# Altium schematic sheet WX0.010.828DL.SchDoc
size A3
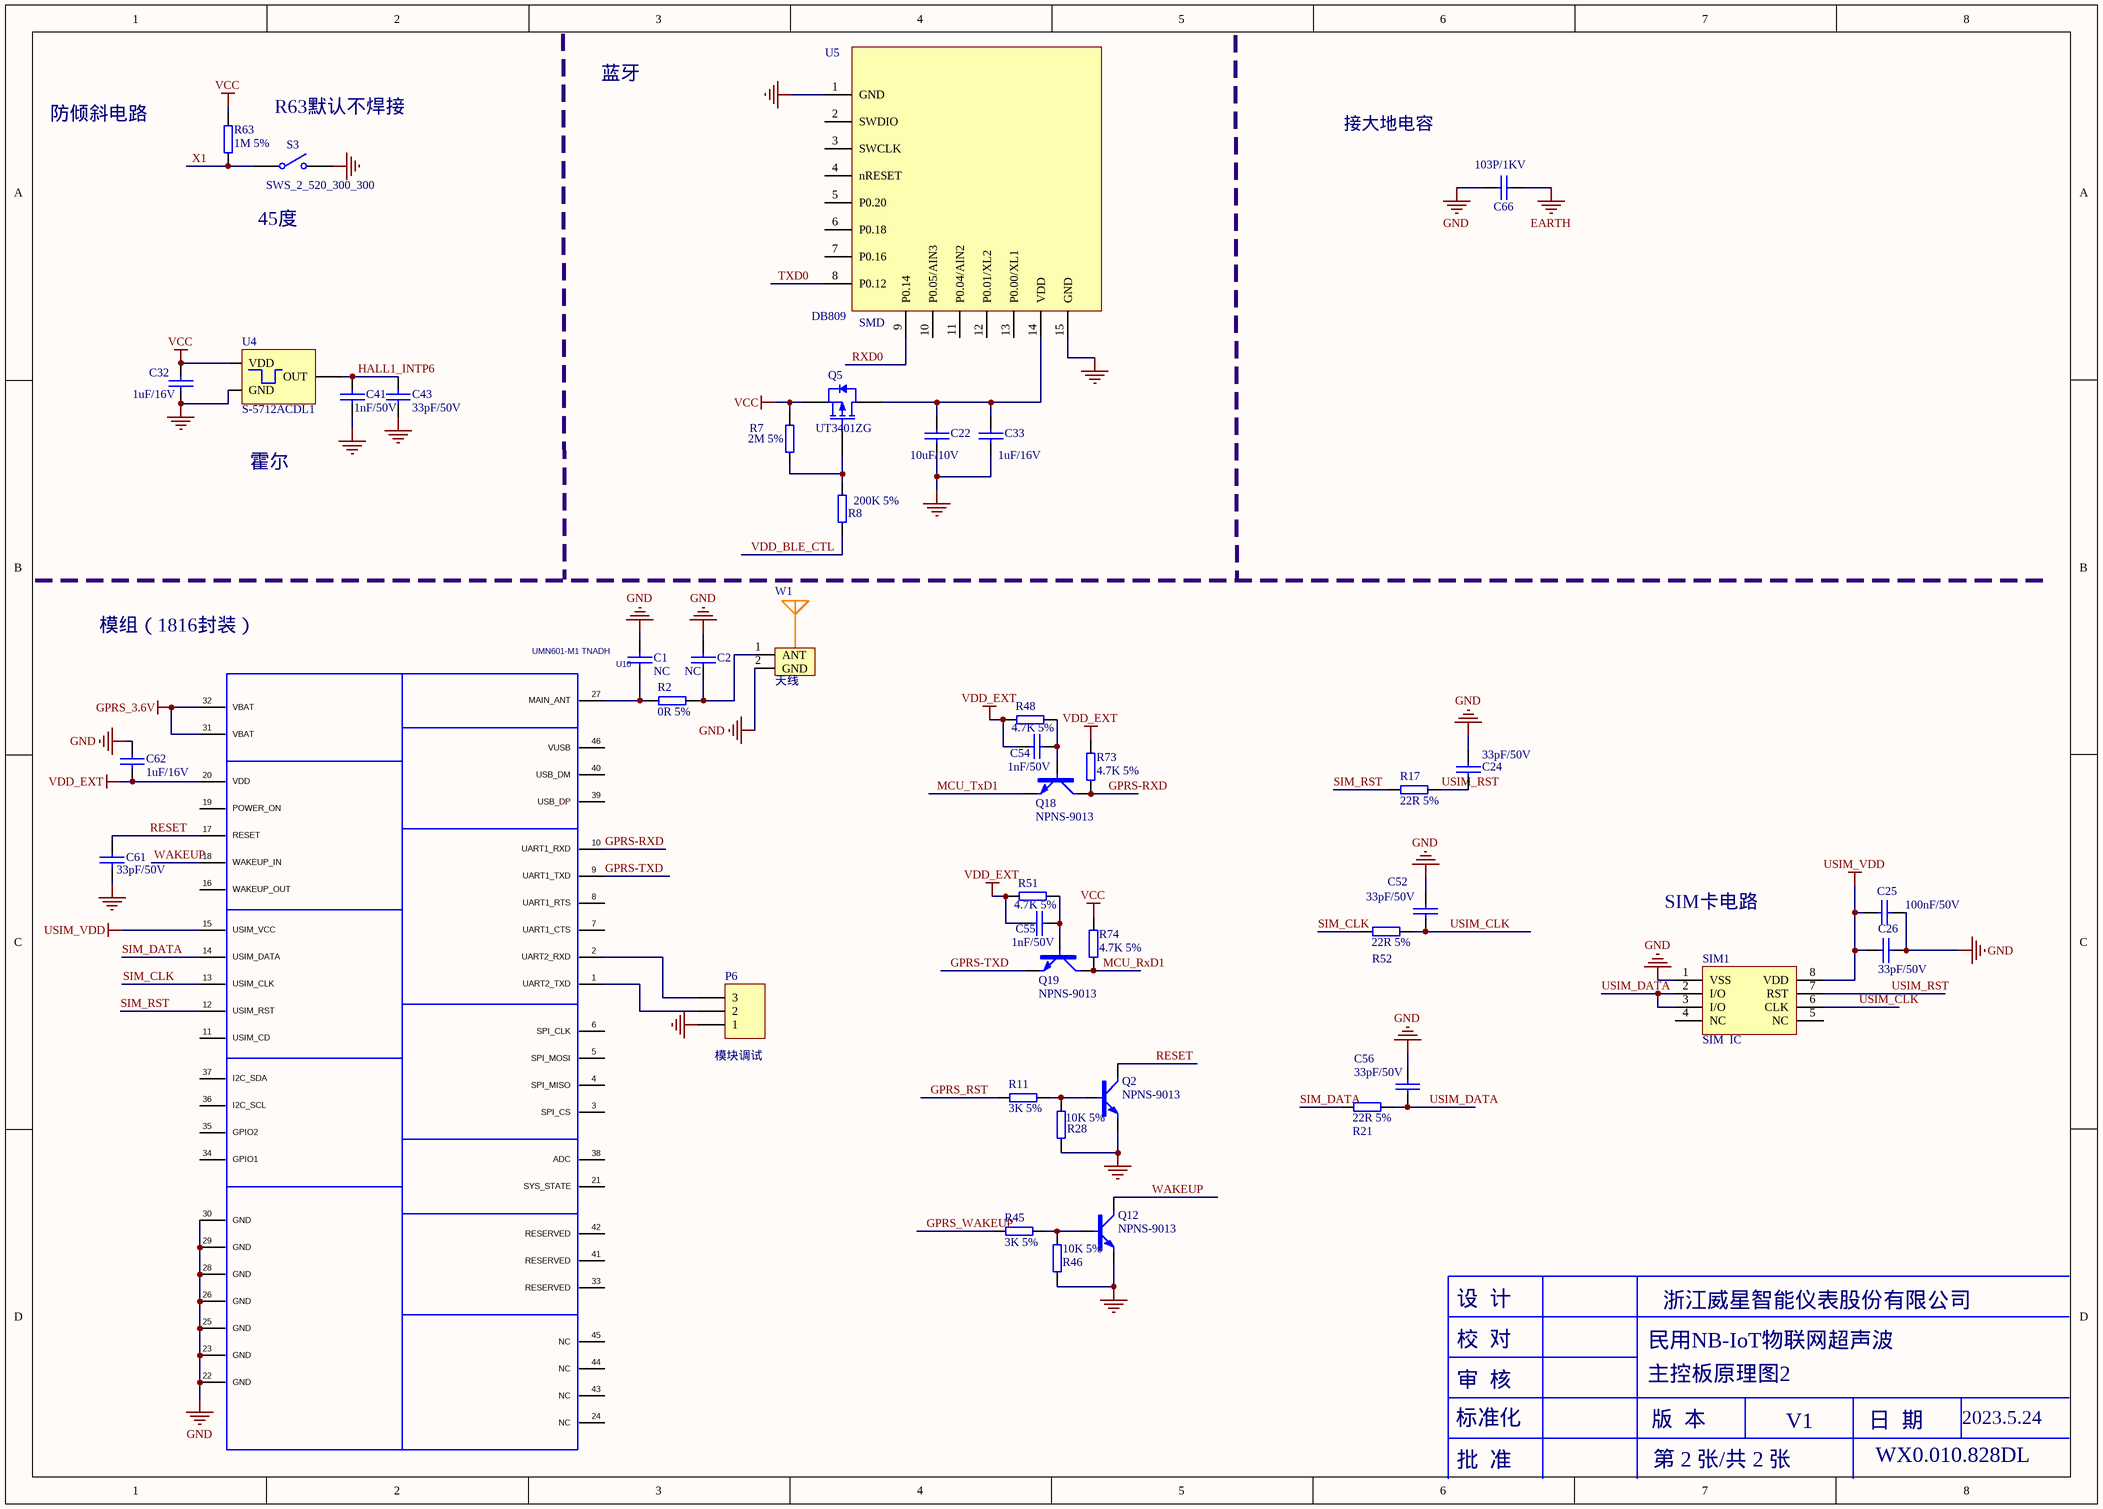
[diagram p0: WX0.010.828DL.SchDoc]

## Parts
C1  NC  [CAP0603]
C2  NC  [CAP0603]
C22  10uF/10V  [CAP0603]
C24  33pF/50V  [CAP0603]
C25  100nF/50V  [CAP0603]
C26  33pF/50V  [CAP0603]
C32  1uF/16V  [CAP0603]
C33  1uF/16V  [CAP0603]
C41  1nF/50V  [CAP0603]
C43  33pF/50V  [CAP0603]
C52  33pF/50V  [CAP0603]
C54  1nF/50V  [CAP0603]
C55  1nF/50V  [CAP0603]
C56  33pF/50V  [CAP0603]
C61  33pF/50V  [CAP0603]
C62  1uF/16V  [CAP0603]
C66  103P/1KV  [CAP1206]
P6  模块调试  [PIN254_1*3*WXHJ]
Q2  NPNS-9013  [SOT-23]
Q5  UT3401ZG  [SOT-23]
Q12  NPNS-9013  [SOT-23]
Q18  NPNS-9013  [SOT-23]
Q19  NPNS-9013  [SOT-23]
R2  0R 5%  [RES0603]
R7  2M 5%  [RES0603]
R8  200K 5%  [RES0603]
R11  3K 5%  [RES0603]
R17  22R 5%  [RES0603]
R21  22R 5%  [RES0603]
R28  10K 5%  [RES0603]
R45  3K 5%  [RES0603]
R46  10K 5%  [RES0603]
R48  4.7K 5%  [RES0603]
R51  4.7K 5%  [RES0603]
R52  22R 5%  [RES0603]
R63  1M 5%  [RES0603]
R73  4.7K 5%  [RES0603]
R74  4.7K 5%  [RES0603]
S3  SWS_2_520_300_300  [SWS_2_520_300]
SIM1  SIM  IC  [SIMIC]
U4  S-5712ACDL1  [SOT-23]
U5  DB809  SMD/DIP: SMD  [DB809]
U10  UMN601-M1 TNADH  [N700-FIXTURE_DL_CFT_CQA]
W1  天线  [ANT-tanpian]

## Nets
EARTH: C66.1
GND: C1.2 C2.2 C22.2 C24.2 C25.1 C26.2 C32.2 C33.2 C41.2 C43.2 C52.2 C56.2 C61.1 C62.2 C66.2 P6.1 Q2.2(E) Q12.2(E) R28.1 R46.1 S3.2 SIM1.1(VSS) U4.3(GND) U5.1(GND) U5.15(GND) U10.22(GND) U10.23(GND) U10.25(GND) U10.26(GND) U10.28(GND) U10.29(GND) U10.30(GND) W1.2(GND)
GPRS_3.6V: U10.31(VBAT) U10.32(VBAT)
USIM_VDD: C25.2 C26.1 SIM1.8(VDD) U10.15(USIM_VCC)
VCC: C32.1 Q5.2(S) R7.2 R63.2 R74.2 U4.1(VDD)
VDD_EXT: C54.1 C55.1 C62.1 R48.2 R51.2 R73.2 U10.20(VDD)
GPRS-RXD: Q18.3(C) R73.1 U10.10(UART1_RXD)
GPRS-TXD: Q19.2(E) U10.9(UART1_TXD)
GPRS_RST: R11.1
GPRS_WAKEUP: R45.1
HALL1_INTP6: C41.1 C43.1 U4.2(OUT)
MCU_RxD1: Q19.3(C) R74.1
MCU_TxD1: Q18.2(E)
RESET: C61.2 Q2.3(C) U10.17(RESET)
RXD0: U5.9(P0.14)
SIM_CLK: R52.1 U10.13(USIM_CLK)
SIM_DATA: R21.1 U10.14(USIM_DATA)
SIM_RST: R17.1 U10.12(USIM_RST)
TXD0: U5.8(P0.12)
USIM_CLK: C52.1 R52.2 SIM1.6(CLK)
USIM_DATA: C56.1 R21.2 SIM1.2(I/O) SIM1.3(I/O)
USIM_RST: C24.1 R17.2 SIM1.7(RST)
VDD_BLE_CTL: R8.1
WAKEUP: Q12.3(C) U10.18(WAKEUP_IN)
X1: R63.1 S3.1
NetC1_1: C1.1 R2.2 U10.27(MAIN_ANT)
NetC2_1: C2.1 R2.1 W1.1(ANT)
NetC22_1: C22.1 C33.1 Q5.3(D) U5.14(VDD)
NetC54_2: C54.2 Q18.1(B) R48.1
NetC55_2: C55.2 Q19.1(B) R51.1
NetP6_2: P6.2 U10.1(UART2_TXD)
NetP6_3: P6.3 U10.2(UART2_RXD)
NetQ2_1: Q2.1(B) R11.2 R28.2
NetQ5_1: Q5.1(G) R7.1 R8.2
NetQ12_1: Q12.1(B) R45.2 R46.2

Not connected (* = marked no-connect by the designer): SIM1 4(NC) 5(NC); U5 2(SWDIO) 3(SWCLK) 4(nRESET) 5(P0.20) 6(P0.18) 7(P0.16) 10(P0.05/AIN3) 11(P0.04/AIN2) 12(P0.01/XL2) 13(P0.00/XL1); U10 3(SPI_CS) 4(SPI_MISO) 5(SPI_MOSI) 6(SPI_CLK) 7(UART1_CTS) 8(UART1_RTS) 11(USIM_CD) 16(WAKEUP_OUT) 19(POWER_ON) 21(SYS_STATE) 24(NC) 33(RESERVED) 34(GPIO1) 35(GPIO2) 36(I2C_SCL) 37(I2C_SDA) 38(ADC) 39(USB_DP) 40(USB_DM) 41(RESERVED) 42(RESERVED) 43(NC) 44(NC) 45(NC) 46(VUSB)

## Notes on the sheet
- R63默认不焊接
- 蓝牙
- 防倾斜电路
- 接大地电容
- 45度
- 霍尔
- 模组（1816封装）
- SIM卡电路
- 设  计
- 浙江威星智能仪表股份有限公司
- 审  核
- 校  对
- 民用NB-IoT物联网超声波
- 主控板原理图2
- 标准化
- 版  本
- V1
- 日  期
- WX0.010.828DL
- 2023.5.24
- 批  准
- 第 2 张/共 2 张

## Library data of the parts
C1 C2 = 101020103-0005: Part Name: 0603贴片电容; ID: 11; SMD/DIP: SMD
C22 = 101020103-0026: 106pF,10 V,±10%,0603,村田,GRM188R61A106KE47D; Part Name: 0603贴片电容; ID: 8; SMD/DIP: SMD; Part Number: 101020103-0026
C24 C26 C43 C52 C56 = 101020103-0027: 33pF,50 V,±10%,0603,国巨,CC0603KRNPO9BN33; Part Name: 0603贴片电容; ID: 17; SMD/DIP: SMD; Part Number: 101020103-0027
C25 = 101020103-0021: 104pF,50 V,±10%,0603,国巨,CC0603KRX7R9BB104; Part Name: 0603贴片电容; ID: 3; SMD/DIP: SMD; Part Number: 101020103-0021
C32 C33 C62 = 101020103-0003: 105pF,16 V,±10%,0603,国巨,CC0603KRX7R7BB105; Part Name: 0603贴片电容; ID: 14; SMD/DIP: SMD; Part Number: 101020103-0003
C41 C54 C55 = 101020103-0022: 102pF,50 V,±10%,0603,国巨,CC0603KRX7R9BB102; Part Name: 0603贴片电容; ID: 13; SMD/DIP: SMD; Part Number: 101020103-0022
C61 = 101020103-0027: 33pF,50 V,±10%,0603,国巨,CC0603KRNPO9BN33; Part Name: 0603贴片电容; ID: 18; SMD/DIP: SMD; Part Number: 101020103-0027
C66 = 101020103-0021: 103P/1KV,±10％,1206; Part Number: 101020101-0003; Part Name: 1206贴片电容; ID: 3; SMD/DIP: SMD
P6 = AD_WXHJ_PinHeader_04: 1*3 ，Φ1.0 ，2.54mm，直脚,无需焊接器件; Part Name: 排针; ID: 27; SMD/DIP: DIP; Part Number: AD_WXHJ_PinHeader_04
Q2 Q12 Q18 Q19 = 101040201-0002: 9013,NPN,SOT-23,长电,S9013; Part Name: 贴片三极管; ID: 14; SMD/DIP: SMD; Part Number: 101040201-0002
Q5 = 101040201-0013: UT3401ZG,P-MOS,SOT-23,UTC,UT3401ZG; Part Name: 功率MOS管; ID: 18; SMD/DIP: SMD; Part Number: 101040201-0013
R2 = 101010103-0001: 国巨,±5%,0603,,155 ℃,-55 ℃,RC0603J2-070RL,无铅,200 ppm/℃,1/10W,,0R; Part Name: 0603贴片电阻; ID: 1; SMD/DIP: SMD; Part Number: 101010103-0001
R7 = 101010103-0025: 国巨,±5%,0603,,155 ℃,-55 ℃,RC0603JR-072ML,含铅,100 ppm/℃,1/10W,,2M; Part Name: 0603贴片电阻; ID: 20; SMD/DIP: SMD; Part Number: 101010103-0025
R8 = 101010103-0034: 200K,±5%,1/10W,0603,国巨,RC0603JR-07200KL; Part Name: 0603贴片电阻; ID: 13; SMD/DIP: SMD; Part Number: 101010103-0034
R11 R45 = 101010103-0006: 国巨,±5%,0603,,155 ℃,-55 ℃,RC0603JR-073KL,无铅,100 ppm/℃,1/10W,,3K; Part Name: 0603贴片电阻; ID: 22; SMD/DIP: SMD; Part Number: 101010103-0006
R17 R21 R52 = 101010103-0009: 国巨,±5%,0603,,155 ℃,-55 ℃,RC0603JR-0722RL,无铅,200 ppm/℃,1/10W,,22欧; Part Name: 0603贴片电阻; ID: 18; SMD/DIP: SMD; Part Number: 101010103-0009
R28 R46 = 101010103-0003: 国巨,±5%,0603,,155 ℃,-55 ℃,RC0603JR-0710KL,无铅,200 ppm/℃,1/10W,,10K; Part Name: 0603贴片电阻; ID: 7; SMD/DIP: SMD; Part Number: 101010103-0003
R48 R51 R73 R74 = 101010103-0042: 4.7K±5%,1/10W,0603; Part Name: 0603贴片电阻; ID: 24; SMD/DIP: SMD; Part Number: 101010103-0042
R63 = 101010103-0002: 国巨,±5%,0603,,155 ℃,-55 ℃,RC0603JR-071ML,无铅,200 ppm/℃,1/10W,,1M; Part Name: 0603贴片电阻; ID: 11; SMD/DIP: SMD; Part Number: 101010103-0002
S3 = 1011001-0041: CSX-SEN-645B,垂直45°开关转换,3*5.2mm,360°任意方位倾斜检测,深圳市成晟科技有限公司; Part Number: 1011001-0051; Part Name: 倾斜开关; ID: 33; SMD/DIP: SMD
SIM1 = SIMCARD_1
U4 = 1010504-0002: S-5712ACDL1,SOT23-3,3.5 V,1.6 V,2 uA,精工电子,S-5712ACDL1; Part Name: 霍尔元件; ID: 2; SMD/DIP: SMD; Part Number: 1010504-0002
U5 = 1011402-0194: 北高智蓝牙模块DB809; Part Name: 蓝牙模块; ID: 15; Part Number: 1011402-0194
U10 = 1011402-0183: N700-58-01,N700-58-01,通信模块,18.0mm*16.0mm*2.1mm,Band 5:850MHz/Band 8:900MHz,深圳市广和通无线股份有限公司; Part Name: NB-IOT模块; ID: 14; PCB DECAL: N700-FIXTURE_DL_CFT_CQA; Part Number: 1011402-0183
W1 = 1010902-0145: UB06000058A,3*3.1*1.25mm,公头,单排,IPEX一代板端; Part Name: IPEX座; ID: 31; SMD/DIP: SMD; Part Number: 1010902-0145